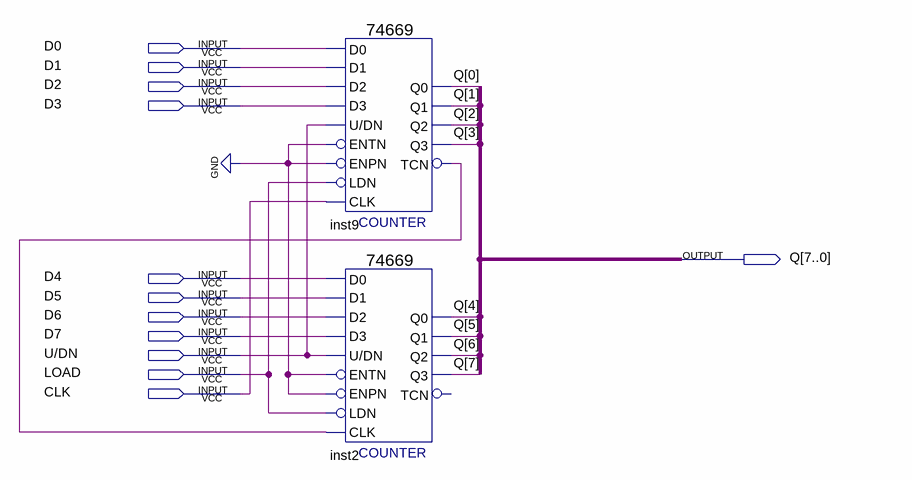
[diagram p0: schematic sheet]
// Quartus schematic Counter.bdf as structural Verilog: 2 symbols, 12 pins
module Counter (
  input  D0,
  input  D1,
  input  D2,
  input  D3,
  input  D4,
  input  D5,
  input  D6,
  input  D7,
  input  \U/DN ,
  input  LOAD,
  input  CLK,
  output [7:0] Q
);

  wire inst9_tcn;

  \74669  inst9 (
    .D1(D1), .D3(D3), .D2(D2), .\U/DN (\U/DN ), .ENTN(1'b0), .LDN(LOAD), .CLK(CLK), .ENPN(1'b0), .D0(D0),
    .Q2(Q[2]), .Q3(Q[3]), .Q1(Q[1]), .Q0(Q[0]), .TCN(inst9_tcn));
  \74669  inst2 (
    .D1(D5), .D3(D7), .D2(D6), .\U/DN (\U/DN ), .ENTN(1'b0), .LDN(LOAD), .CLK(inst9_tcn), .ENPN(1'b0),
    .D0(D4), .Q2(Q[6]), .Q3(Q[7]), .Q1(Q[5]), .Q0(Q[4]));  // open: TCN
endmodule
